# EAGLE design benchPS (EAGLE 6.5.0)
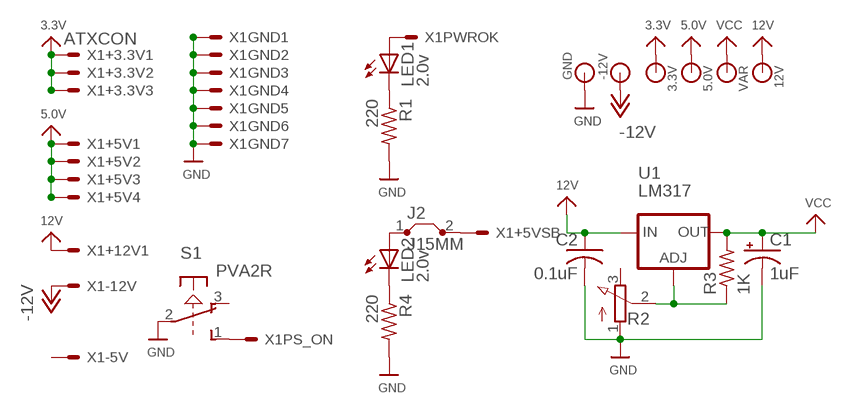
[diagram p0: schematic, sheet 1]

## Parts
3.3V  BANANA_CONN  [BANANA_CONN]
5.0V  BANANA_CONN  [BANANA_CONN]
12V  BANANA_CONN  [BANANA_CONN]
-12V  BANANA_CONN  [BANANA_CONN]
C1  1uF  CPOL-USE3.5-8  [E3,5-8]
C2  0.1uF  C-US050-025X075  [C050-025X075]
GND  BANANA_CONN  [BANANA_CONN]
J2  J15MM  [15]
LED1  2.0v  LED3MM  [LED3MM]
LED2  2.0v  LED3MM  [LED3MM]
R1  220  R-US_0204/7  [0204/7]
R2  3RP/1610N  [3RP/1610N]
R3  1K  R-US_0204/7  [0204/7]
R4  220  R-US_0204/7  [0204/7]
S1  PVA2R  [PVA2R]
U1  LM317  V_REG_317SINK  [TO220-ADJ]
VAR  BANANA_CONN  [BANANA_CONN]
X1  ATXCON  [5566-20]

## Nets
3.3V: 3.3V.P$1 X1.1 X1.2 X1.11
5.0V: 5.0V.P$1 X1.4 X1.6 X1.19 X1.20
12V: 12V.P$1 C2.1 U1.IN X1.10
-12V: -12V.P$1 X1.12
GND: C1.- C2.2 GND.P$1 R1.2 R2.1(A) R4.2 S1.2(1:P) X1.3 X1.5 X1.7 X1.13 X1.15 X1.16 X1.17
N$1: LED1.A X1.8
N$2: LED1.K(C) R1.1
N$3: S1.1(1:S) X1.14
N$4: R2.2(S) R3.1 U1.ADJ
N$5: J2.2 X1.9
N$6: LED2.K(C) R4.1
N$7: J2.1 LED2.A
VCC: C1.+ R3.2 U1.OUT VAR.P$1
Unconnected: R2.3(E) S1.3(1:O) S1.4(2:S) S1.5(2:P) S1.6(2:O) X1.18

## Library data of the parts
3.3V 5.0V 12V -12V GND VAR = SparkFun-Connectors:BANANA_CONN: Through-hole banana jack
C1 = rcl:CPOL-US: POLARIZED CAPACITOR, American symbol
C2 = rcl:C-US: CAPACITOR, American symbol
J2 = jumper:J: Bridge
LED1 = led:LED: LED OSRAM: - CHIPLED LG R971, LG N971, LY N971, LG Q971, LY Q971, LO R971, LY R971 LH N974, LH R974 LS Q976, LO Q976, LY Q976 LO Q996 - Hyper CHIPLED LW Q18S LB Q993, LB Q99A, LB R99A - SideLED LS A670, LO A670, LY A670, LG A670, LP A670 LB A673, LV A673, LT A673, LW A673 LH A674 LY A675 LS A676, LA A676, LO A676, LY A676, LW A676 LS A679, LY A679, LG A679 - Hyper Micro SIDELED® LS Y876, LA Y876, LO Y876, LY Y876 LT Y87S - SmartLED LW L88C, LW L88S LB L89C, LB L89S, LG L890 LS L89K, LO L89K, LY L89K LS L896, LA L896, LO L896, LY L896 - TOPLED LS T670, LO T670, LY T670, LG T670, LP T670 LSG T670, LSP T670, LSY T670, LOP T670, LYG T670 LG T671, LOG T671, LSG T671 LB T673, LV T673, LT T673, LW T673 LH T674 LS T676, LA T676, LO T676, LY T676, LB T676, LH T676, LSB T676, LW T676 LB T67C, LV T67C, LT T67C, LS T67K, LO T67K, LY T67K, LW E67C LS E67B, LA E67B, LO E67B, LY E67B, LB E67C, LV E67C, LT E67C LW T67C LS T679, LY T679, LG T679 LS T770, LO T770, LY T770, LG T770, LP T770 LB T773, LV T773, LT T773, LW T773 LH T774 LS E675, LA E675, LY E675, LS T675 LS T776, LA T776, LO T776, LY T776, LB T776 LHGB T686 LT T68C, LB T68C - Hyper Mini TOPLED® LB M676 - Mini TOPLED Santana® LG M470 LS M47K, LO M47K, LY M47K Source: http://www.osram.convergy.de LUXEON: - LUMILED® LXK2-PW12-R00, LXK2-PW12-S00, LXK2-PW14-U00, LXK2-PW14-V00 LXK2-PM12-R00, LXK2-PM12-S00, LXK2-PM14-U00 LXK2-PE12-Q00, LXK2-PE12-R00, LXK2-PE12-S00, LXK2-PE14-T00, LXK2-PE14-U00 LXK2-PB12-K00, LXK2-PB12-L00, LXK2-PB12-M00, LXK2-PB14-N00, LXK2-PB14-P00, LXK2-PB14-Q00 LXK2-PR12-L00, LXK2-PR12-M00, LXK2-PR14-Q00, LXK2-PR14-R00 LXK2-PD12-Q00, LXK2-PD12-R00, LXK2-PD12-S00 LXK2-PH12-R00, LXK2-PH12-S00 LXK2-PL12-P00, LXK2-PL12-Q00, LXK2-PL12-R00 Source: www.luxeon.com KINGBRIGHT: KA-3528ASYC Source: www.kingbright.com; RED: 2.0V
LED2 = led:LED: LED OSRAM: - CHIPLED LG R971, LG N971, LY N971, LG Q971, LY Q971, LO R971, LY R971 LH N974, LH R974 LS Q976, LO Q976, LY Q976 LO Q996 - Hyper CHIPLED LW Q18S LB Q993, LB Q99A, LB R99A - SideLED LS A670, LO A670, LY A670, LG A670, LP A670 LB A673, LV A673, LT A673, LW A673 LH A674 LY A675 LS A676, LA A676, LO A676, LY A676, LW A676 LS A679, LY A679, LG A679 - Hyper Micro SIDELED® LS Y876, LA Y876, LO Y876, LY Y876 LT Y87S - SmartLED LW L88C, LW L88S LB L89C, LB L89S, LG L890 LS L89K, LO L89K, LY L89K LS L896, LA L896, LO L896, LY L896 - TOPLED LS T670, LO T670, LY T670, LG T670, LP T670 LSG T670, LSP T670, LSY T670, LOP T670, LYG T670 LG T671, LOG T671, LSG T671 LB T673, LV T673, LT T673, LW T673 LH T674 LS T676, LA T676, LO T676, LY T676, LB T676, LH T676, LSB T676, LW T676 LB T67C, LV T67C, LT T67C, LS T67K, LO T67K, LY T67K, LW E67C LS E67B, LA E67B, LO E67B, LY E67B, LB E67C, LV E67C, LT E67C LW T67C LS T679, LY T679, LG T679 LS T770, LO T770, LY T770, LG T770, LP T770 LB T773, LV T773, LT T773, LW T773 LH T774 LS E675, LA E675, LY E675, LS T675 LS T776, LA T776, LO T776, LY T776, LB T776 LHGB T686 LT T68C, LB T68C - Hyper Mini TOPLED® LB M676 - Mini TOPLED Santana® LG M470 LS M47K, LO M47K, LY M47K Source: http://www.osram.convergy.de LUXEON: - LUMILED® LXK2-PW12-R00, LXK2-PW12-S00, LXK2-PW14-U00, LXK2-PW14-V00 LXK2-PM12-R00, LXK2-PM12-S00, LXK2-PM14-U00 LXK2-PE12-Q00, LXK2-PE12-R00, LXK2-PE12-S00, LXK2-PE14-T00, LXK2-PE14-U00 LXK2-PB12-K00, LXK2-PB12-L00, LXK2-PB12-M00, LXK2-PB14-N00, LXK2-PB14-P00, LXK2-PB14-Q00 LXK2-PR12-L00, LXK2-PR12-M00, LXK2-PR14-Q00, LXK2-PR14-R00 LXK2-PD12-Q00, LXK2-PD12-R00, LXK2-PD12-S00 LXK2-PH12-R00, LXK2-PH12-S00 LXK2-PL12-P00, LXK2-PL12-Q00, LXK2-PL12-R00 Source: www.luxeon.com KINGBRIGHT: KA-3528ASYC Source: www.kingbright.com; GREEN: 2.0V
R1 R3 R4 = rcl:R-US_: RESISTOR, American symbol
R2 = pot:3RP/1610N: 16mm Potentiometer one level Source: http://www.alphapotentiometers.net/html/16mm_pot_2.html
S1 = switch-misc:PVA2R: ITT SWITCH
U1 = SparkFun-PowerIC:V_REG_317: Voltage Regulator Standard LM317 adjustable voltage regulator. AOI (Adjust Output Input). Google 'LM317 Calculator' for easy to use app to get the two resistor values needed. 240/720 for 5V output. 240/390 for 3.3V output. Spark Fun Electronics SKU : COM-00527
X1 = atx:ATXCON: Mini FIT connector 20 pol ATX PC-Motherboard Power connector Source: http://www.molex.com; OC_FARNELL: unknown; OC_NEWARK: unknown

## Board
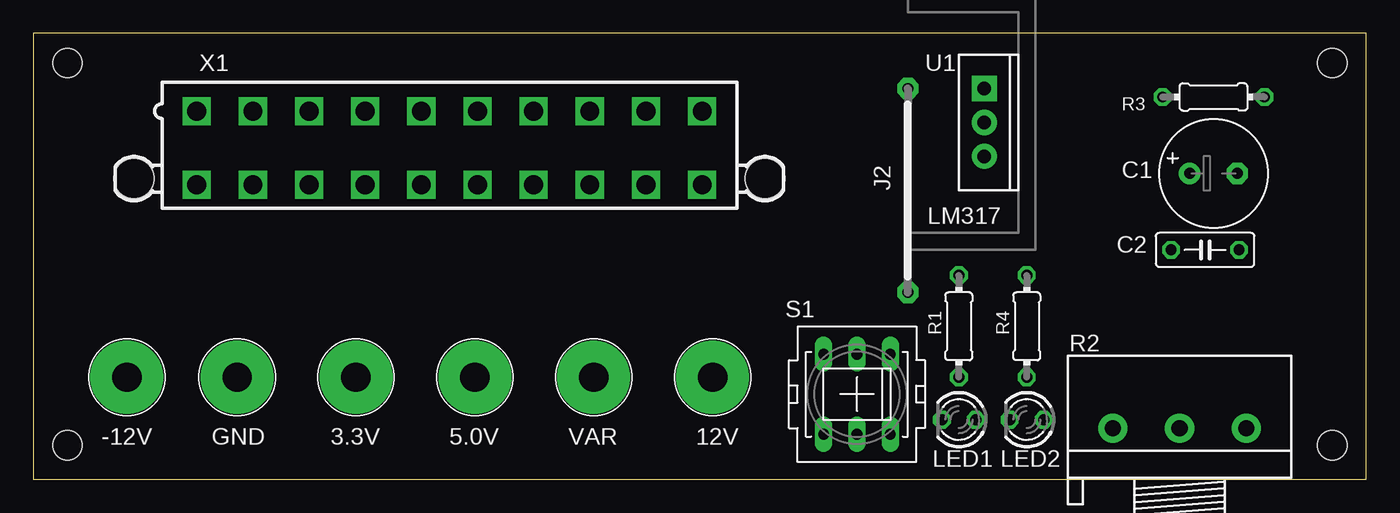
[diagram p1: board, top side]
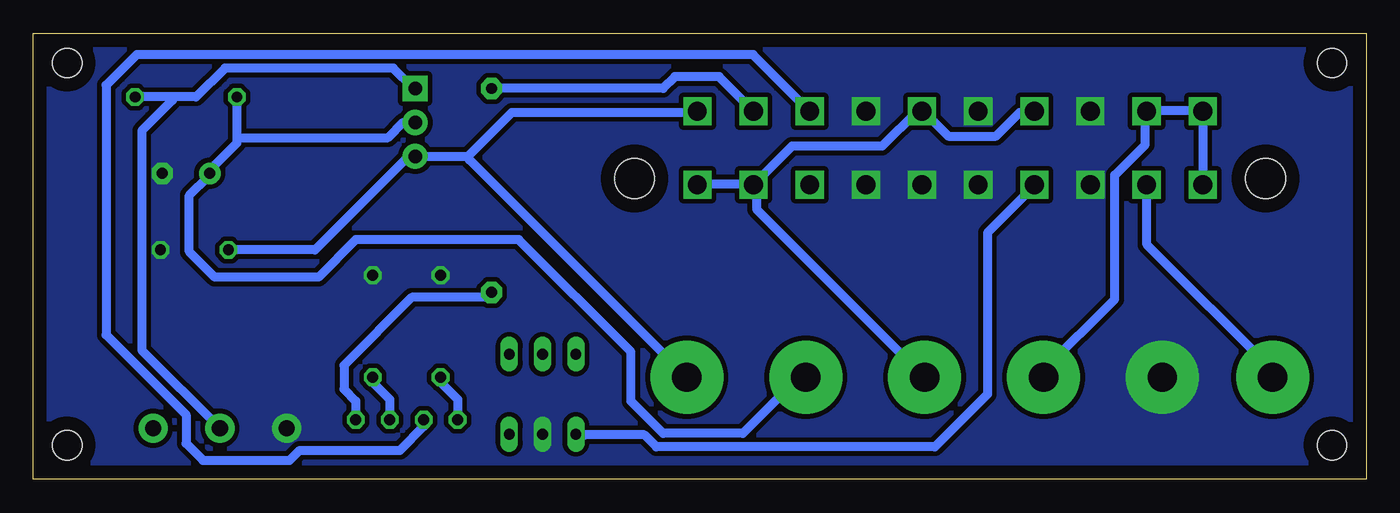
[diagram p2: board, bottom side, seen from below]

Size 99.67 x 33.33 mm. Coordinates in mm from the lower left corner, seen from the top.
Outline: 0,0 99.67,0 99.67,33.33 0,33.33 0,0
Copper layers (1*16): Top 0.035mm / dielectric 1.5mm / Bottom 0.035mm
Design rules "default *": minimum track width 26mil, minimum drill 24mil, track to track 14mil, track to pad 14mil, pad to pad 8mil, via to via 8mil, smd to smd 8mil, copper to edge 40mil, drill to drill 8mil, minimum pad ring 10mil, minimum via ring 8mil, stop-mask expansion 4mil, vias tented up to drill 0mil, thermal gap 10mil
Holes 2.2 mm at 2.54,2.54 2.54,31.11 97.16,31.11 97.16,2.54

### Footprints (pad centres in the part's own frame; a part is rotated, then mirrored left to right if it is on the bottom)
BANANA_CONN = drill 2.2 pad 5.461: P$1 0,0
E3,5-8 = drill 0.813 pad 1.6: + -1.778,0 | drill 0.813 pad 1.6 octagon: - 1.778,0
C050-025X075 = drill 0.813 octagon: 1 -2.54,0; 2 2.54,0
15 = drill 0.813 pad 1.6 octagon: 1 -7.62,0; 2 7.62,0
LED3MM = drill 0.813 octagon: A -1.27,0; K 1.27,0
0204/7 = drill 0.813 octagon: 1 -3.81,0; 2 3.81,0
3RP/1610N = drill 1.2 pad 2.184: 1 -5,0; 2 0,0; 3 5,0
PVA2R = drill 0.813 long: 1 -2.997,2.489; 2 -2.997,0; 3 -2.997,-2.489; 4 2.997,2.489; 5 2.997,0; 6 2.997,-2.489
TO220-ADJ = drill 1 pad 1.88 square: ADJ -2.54,0 | drill 1 pad 1.88: IN 2.54,0; OUT 0,0
5566-20 = drill 1.4 square: 1 18.9,-2.75; 2 14.7,-2.75; 3 10.5,-2.75; 4 6.3,-2.75; 5 2.1,-2.75; 6 -2.1,-2.75; 7 -6.3,-2.75; 8 -10.5,-2.75; 9 -14.7,-2.75; 10 -18.9,-2.75; 11 18.9,2.75; 12 14.7,2.75; 13 10.5,2.75; 14 6.3,2.75; 15 2.1,2.75; 16 -2.1,2.75; 17 -6.3,2.75; 18 -10.5,2.75; 19 -14.7,2.75; 20 -18.9,2.75 | hole 3: 23.6,2.29; -23.6,2.29

### Placement (x,y rotation side)
3.3V  24.13,7.62 0 top
5.0V  33.02,7.62 0 top
12V  50.8,7.62 0 top
-12V  6.99,7.62 0 top
C1  88.27,22.86 0 top
C2  87.63,17.14 0 top
GND  15.24,7.62 0 top
J2  65.41,21.59 90 top
LED1  69.22,4.45 180 top
LED2  74.3,4.45 180 top
R1  69.22,11.43 90 top
R2  85.72,3.81 0 top
R3  88.27,28.57 180 top
R4  74.3,11.43 90 top
S1  61.59,6.35 90 top
U1  71.12,26.67 270 top
VAR  41.91,7.62 0 top
X1  31.11,24.77 180 top

### Tracks (layer width: path | path; a pad name or v marks a point on that pad's centre or on a via)
3.3V
  Bottom 0.66: X1.11 12.19,22.1 12.19,27.43 X1.1 12.45,27.56 16.38,27.56 X1.2 16.51,27.18 16.51,25.02 18.8,22.73 18.8,13.46 24.13,8.13 3.3V.P$1
5.0V
  Bottom 0.66: X1.19 45.85,22.1 49.91,22.1 X1.20 | X1.4 24.89,27.43 25.91,27.43 27.69,25.65 31.24,25.65 33.15,27.56 X1.6 33.53,27.56 36.2,24.89 42.93,24.89 45.59,22.23 X1.19 | 5.0V.P$1 45.59,20.19 45.59,21.84 X1.19
12V
  Bottom 0.66: C2.1 78.61,17.14 71.63,24.13 U1.IN 67.18,24.13 | 67.18,24.13 63.88,27.43 50.04,27.43 X1.10 | 12V.P$1 67.06,23.88 67.18,24.13
-12V
  Bottom 0.66: -12V.P$1 6.99,8.13 16.38,17.53 16.38,21.97 X1.12
GND
  pour Bottom (no thermals): 0,33.02 99.69,33.66 99.69,0 0,0
N$1
  Bottom 0.66: LED1.A 70.48,3.94 72.26,2.16 79.76,2.16 80.52,1.4 87,1.4 88.27,2.67 88.27,4.83 94.23,10.79 94.23,29.46 91.95,31.75 45.85,31.75 41.66,27.56 X1.8
N$2
  Bottom 0.66: LED1.K 67.94,5.97 69.22,7.24 R1.1
N$3
  Bottom 0.66: S1.1 58.42,3.3 53.98,3.3 53.09,2.41 32.26,2.41 28.32,6.35 28.32,18.41 24.77,21.97 X1.14
N$4
  Bottom 0.66: 89.28,28.57 87.5,28.57 85.34,30.73 72.77,30.73 71.25,29.21 U1.ADJ | 89.28,28.57 R3.1 | R2.2 91.57,9.65 91.57,26.04 89.28,28.32 89.28,28.57
N$5
  Bottom 0.66: J2.2 52.58,29.21 51.69,30.1 48.39,30.1 45.85,27.56 X1.9
N$6
  Bottom 0.66: LED2.K 73.03,5.97 74.3,7.24 R4.1
N$7
  Bottom 0.66: LED2.A 75.56,5.84 76.45,6.73 76.45,8.51 71.37,13.59 65.79,13.59 J2.1
VCC
  Bottom 0.66: 84.45,25.53 84.45,25.15 86.49,23.11 C1.+ 86.61,22.61 88.01,21.21 88.01,17.02 86.11,15.11 78.36,15.11 75.56,17.91 63.37,17.91 54.99,9.53 54.99,5.84 52.58,3.43 46.61,3.43 42.42,7.62 VAR.P$1 | 84.45,25.53 R3.2 | U1.OUT 72.01,26.67 73.15,25.53 84.45,25.53